# Altium schematic sheet MCU.SchDoc
size A4; SheetNumber: 3; SheetTotal: 6
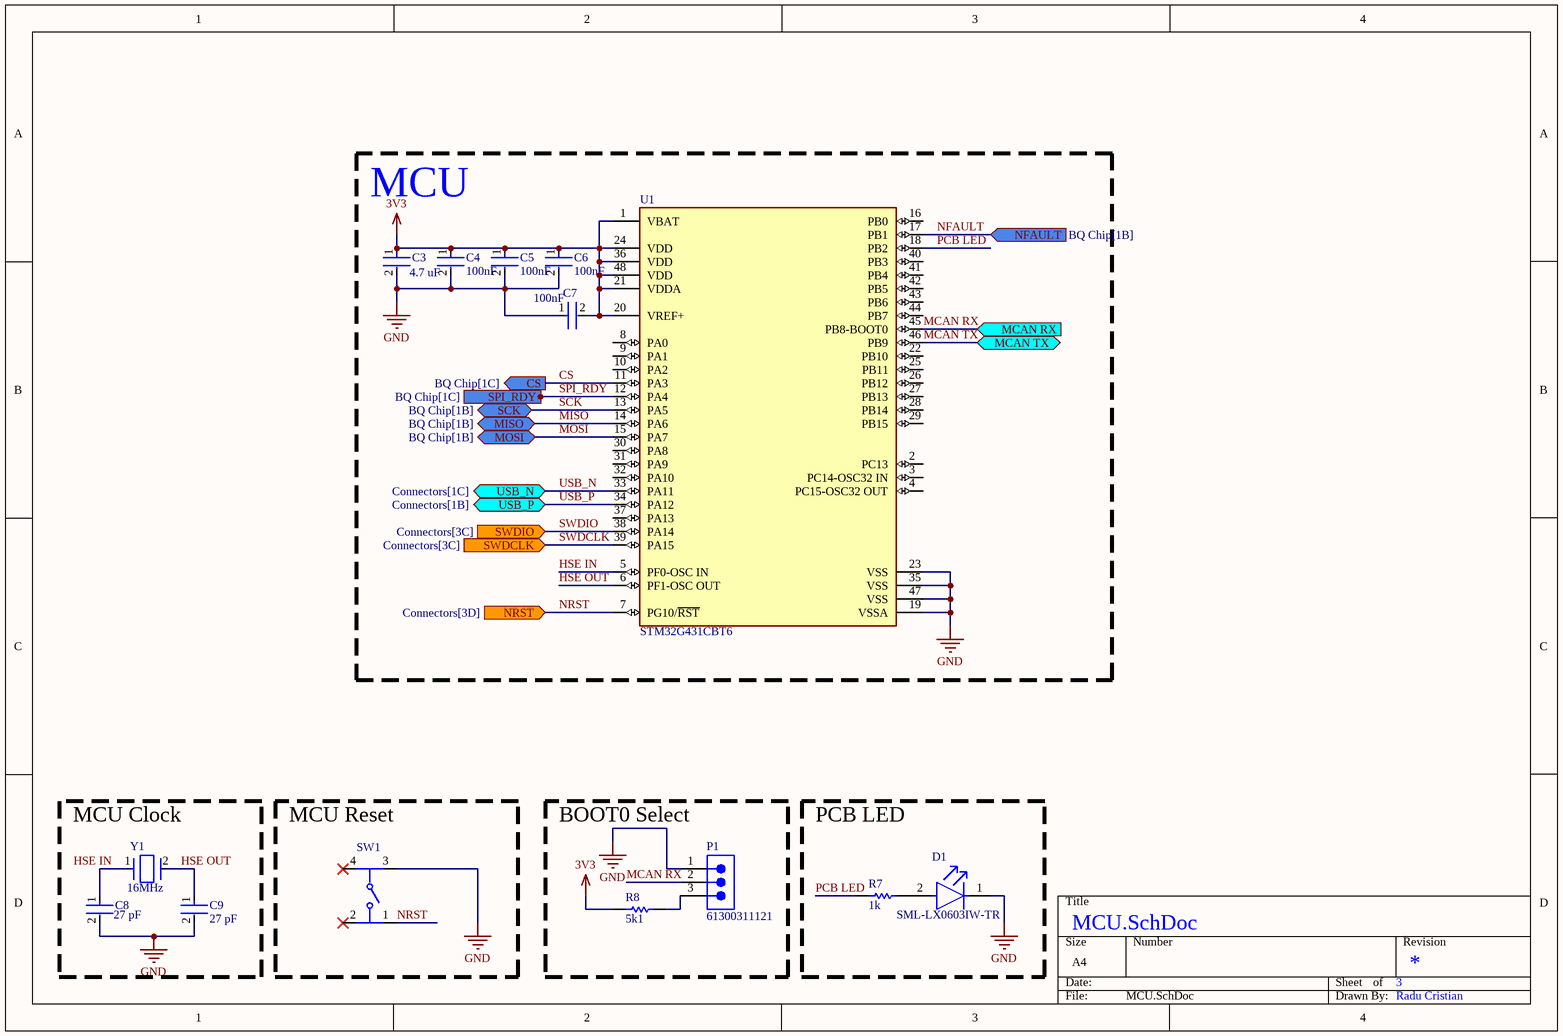
[diagram p0: MCU.SchDoc]

## Parts
C3  Capacitance: 4.7 uF  [FP-CC0603-DA-MFG]  (hidden comment: CC0603KRX5R5BB475)
C4  Capacitance: 100nF  [FP-CC0603-DA-IPC_A]  (hidden comment: CC0603JRX7R9BB104)
C5  Capacitance: 100nF  [FP-CC0603-DA-IPC_A]  (hidden comment: CC0603JRX7R9BB104)
C6  Capacitance: 100nF  [FP-CC0603-DA-IPC_A]  (hidden comment: CC0603JRX7R9BB104)
C7  Capacitance: 100nF  [FP-CC0603-DA-IPC_A]  (hidden comment: CC0603JRX7R9BB104)
C8  value 27 pF  [FP-C0603C-CF-MFG]  (hidden comment: C0603C270J5GACTU)
C9  value 27 pF  [FP-C0603C-CF-MFG]  (hidden comment: C0603C270J5GACTU)
D1  SML-LX0603IW-TR  [FP-SML-LX0603IW-TR-MFG]
P1  61300311121  [61300311121]
R7  Parameter 1: 1k  [RESC2013X70X40ML20T20]  (hidden comment: ERJ-6ENF1001V)
R8  Parameter 1: 5k1  [RESC2013X60X30NL20T20]  (hidden comment: RK73H2ATTD5101F)
SW1  PTS810SJM250SMTRLFS  [FP-PTS810SJM250SMTRLFS-MFG]  (value not drawn)
U1  STM32G431CBT6  [FP-LQFP48-5B-MFG]
Y1  Frequency: 16MHz  [FP-ABM3-MFG]  (hidden comment: ABM3-16.000MHZ-D2Y-T)

## Blocks framed on the sheet
MCU: C3-C7 U1
MCU Clock: C8 C9 Y1
MCU Reset: SW1
BOOT0 Select: P1 R8
PCB LED: D1 R7

## Ports
CS (out, see BQ Chip[1C]), MCAN RX (in, see Communication[1D]), MCAN TX (bidir, see Communication[1D]), MISO (bidir, see BQ Chip[1B]), MOSI (bidir, see BQ Chip[1B]), NFAULT (in, see BQ Chip[1B]), NRST (in, see Connectors[3D]), SCK (bidir, see BQ Chip[1B]), SPI_RDY (out, see BQ Chip[1C]), SWDCLK (in, see Connectors[3C]), SWDIO (in, see Connectors[3C]), USB_N (bidir, see Connectors[1C]), USB_P (bidir, see Connectors[1B])

## Nets
3V3: C3.1 C4.1 C5.1 C6.1 C7.2 R8.2 U1.1(VBAT) U1.20(VREF+) U1.21(VDDA) U1.24(VDD) U1.36(VDD) U1.48(VDD)
GND: C3.2 C4.2 C5.2 C6.2 C7.1 C8.2 C9.2 D1.1(C) P1.1 SW1.3 U1.19(VSSA) U1.23(VSS) U1.35(VSS) U1.47(VSS)
CS: U1.11(PA3) ; port CS
HSE IN: C8.1 U1.5(PF0-OSC_IN) Y1.1
HSE OUT: C9.1 U1.6(PF1-OSC_OUT) Y1.2
MCAN RX: P1.2 U1.45(PB8-BOOT0) ; port MCAN RX
MCAN TX: U1.46(PB9) ; port MCAN TX
MISO: U1.14(PA6) ; port MISO
MOSI: U1.15(PA7) ; port MOSI
NFAULT: U1.17(PB1) ; port NFAULT
NRST: SW1.1 U1.7(PG10/~{RST}) ; port NRST
PCB LED: R7.1 U1.18(PB2)
SCK: U1.13(PA5) ; port SCK
SPI_RDY: U1.12(PA4) ; port SPI_RDY
SWDCLK: U1.39(PA15) ; port SWDCLK
SWDIO: U1.38(PA14) ; port SWDIO
USB_N: U1.33(PA11) ; port USB_N
USB_P: U1.34(PA12) ; port USB_P
NetD1_2: D1.2(A) R7.2
NetP1_3: P1.3 R8.1

Not connected (* = marked no-connect by the designer): SW1 2* 4*; U1 2(PC13) 3(PC14-OSC32_IN) 4(PC15-OSC32_OUT) 8(PA0) 9(PA1) 10(PA2) 16(PB0) 22(PB10) 25(PB11) 26(PB12) 27(PB13) 28(PB14) 29(PB15) 30(PA8) 31(PA9) 32(PA10) 37(PA13) 40(PB3) 41(PB4) 42(PB5) 43(PB6) 44(PB7)

## Notes on the sheet
- Radu Cristian

## Library data of the parts
C3 = CMP-03422-000495-1: CAP CER 4.7UF 6.3V X5R 0603; Manufacturer: YAGEO; Tolerance: 0.1; Temperature Coefficient: 15%; Material: Ceramic; Voltage Rating: 6.3 V; Height: 0.9mm; Temperature Characteristic: X5R; Value: 4.7 uF; ComponentLink2Description: Datasheet; Mouser Description: Multilayer Ceramic Capacitor, CC Series, 4.7 - F, - 10%, X5R, 6.3 V, 0603 [1608 Metric]; Manufacturer Part Number: CC0603KRX5R5BB475; Voltage: 6.3 V; Device Class L3: Ceramic Capacitors; Temperature: -55°C to +125°C; Octopart: https://octopart.com/cc0603krx5r5bb475-yageo-42244632; Digikey Description: CAP CER 4.7UF 6.3V X5R 0603; Package: CC0603-DA; Device Class L2: Capacitors; Category: Cap; Footprint Url: http://www.yageo.com/exep/pages/download/literatures/UPY-C_GEN_24.pdf; ComponentLink2URL: http://www.yageo.com/documents/recent/UPY-GPHC_X7R_6.3V-to-50V_18.pdf; Temperature Range High: +125°C; Automotive: No; Temperature Range Low: -55°C; Lead Free: Yes; Device Class L1: Passive Components; RoHS: TRUE
C4-C7 = CMP-03422-001490-1: CAP CER 0.1UF 50V X7R 0603; Tolerance: 5%; Number of Pins: 2; Depth: 0.8mm; Weight: 7.1E-05oz; Radiation Hardening: No; Case Code (Metric): 1608; Dielectric: X7R; Max Operating Temperature: 125°C; Voltage Rating (DC): 50V; Case/Package: 0603; Halogen Free: Halogen Free; Mount: Surface Mount; Lead Free: Lead Free; Termination: SMD/SMT; RoHS Compliant: Yes; Length: 1.6mm; Series: CC; Resistor Type: Ceramic; Case Code (Imperial): 0603; Construction: Flat; Width: 0.031inch; Height: 0.8mm; Voltage Rating: 50V; Min Operating Temperature: -55°C; Thickness: 0.035inch; Packaging: Tape and Reel
C8 C9 = CMP-2006-03314-2: CAP CER 27PF 50V C0G/NP0 0603; Manufacturer: KEMET; Tolerance: 0.05; Material: Ceramic; Automotive Grade: Grade 1; Temperature Characteristic: C0G; Temperature Coefficient: 30ppm/°C; RoHS: TRUE; Lead Free: Yes; Automotive: Yes; Category: Cap; Digikey Description: CAP CER 27PF 50V C0G/NP0 0603; Device Class L3: Ceramic Capacitors; Capacitance: 27 pF; Temperature Range High: +125°C; Octopart: https://octopart.com/c0603c270j5gactu-kemet-136059; Temperature Range Low: -55°C; ComponentLink2URL: https://api.kemet.com/component-edge/download/datasheet/C0603C100J5GACAUTO.pdf; Device Class L2: Capacitors; Mouser Description: Multilayer Ceramic Capacitors MLCC - SMD/SMT 50volts 27pF C0G 5%; Device Class L1: Passive Components; ComponentLink2Description: Datasheet; Voltage Rating: 50 V; Package: C0603C-CF; Height: 0.87mm; Temperature: -55°C to +125°C; Manufacturer Part Number: C0603C270J5GACTU
D1 = CMP-57192-000012-1: LED RED DIFFUSED SMD; Luminous Intensity: 14mcd; Test Current: 20mA; Viewing Angle: 160°; Approvals: UL; Forward Voltage: 2V; Power Dissipation: 50mW; Dominant Wavelength: 635nm; Number of LEDs: 1; Lens Color: White; Height: 0.6mm; RoHS Compliant: Yes; Lead Free: Lead Free; Number of Pins: 2; Packaging: Tape and Reel; Case/Package: 0603; Length: 1.6mm; Color: Red; Max Operating Temperature: 85°C; Illumination Color: Red; Case Code (Metric): 1608; Diameter: 0.061inch; Min Operating Temperature: -25°C; Lens Style: Diffused; Mount: Surface Mount; Width: 0.8mm; Case Code (Imperial): 0603; Lens Transparency: Diffused; Wavelength: 635nm; Package Quantity: 1; Forward Current: 20mA
P1 = CMP-1502-01062-3: NexarPartId: 32855521; Current Rating: 3A; Voltage Rating: 250V; Number of Positions: 3; Pitch: 2.54mm; Contact Resistance: 20mΩ; Connector Type: Male Pin; Gender: Male; REACH SVHC: Unknown; Packaging: Bulk; Contact Material: Copper; Min Operating Temperature: -40°C; Number of Rows: 1; Orientation: Vertical; RoHS: Compliant; Contact Plating: Gold; Max Operating Temperature: 105°C; Mount: Through Hole; Height: 8.94mm; Operating Supply Voltage: 250V; Number of Pins: 3; Contact Mating Length: 5.9944mm; Number of Contacts: 3; Color: Black; Lead Free: Lead Free; Lead Pitch: 2.54mm; Termination: Solder
R7 = CMP-2001-04375-5: Chip Resistor, 1 KOhm, +/- 1%, 0.125 W, -55 to 155 degC, 0805 (2012 Metric), RoHS, Tape and Reel; Manufacturer: Panasonic; Voltage Rating: 150 V; ComponentLink1URL: http://www.panasonic.com/; ComponentLink2Description: Datasheet; REACH SVHC: Yes; ComponentLink1Description: Manufacturer URL; Length: 2 mm; Height: 0.6 mm; Package Quantity: 1; PackageDescription: 2-Pin Surface Mount Device, Body 2 x 1.25 mm; Packaging: Cut Tape; PackageReference: 0805; Max Operating Temperature: 155 degC; Mounting Technology: Surface Mount; ComponentLink2URL: http://industrial.panasonic.com/cdbs/www-data/pdf/RDA0000/AOA0000C86.pdf; DatasheetVersion: 04/2015; Min Operating Temperature: -55 degC; RoHSCompliant: true; Mount: Surface Mount
R8 = CMP-2001-02431-1: Manufacturer: KOA Speer; Part Number: RK73H2ATTD5101F
SW1 = CMP-10040-000001-2: SWITCH TACTILE SPST-NO 0.05A 16V; Throw Configuration: SPST; Operating Force: 160gf; Actuator Type: Standard; Switch Travel: 0.15mm; Switch Function: Off-Mom; Max Current Rating: 50mA; Mechanical Life: 150000Cycles; Illumination Type: Non-Illuminated; Package Quantity: 2900; Depth: 4.6mm; Mount: Surface Mount; Packaging: Tape and Reel; Length: 3.2mm; RoHS Compliant: Yes; Case/Package: SMD/SMT; Voltage Rating (DC): 16V; Min Operating Temperature: -40°C; Termination: J-Bend; Lead Free: Lead Free; Contact Plating: Silver; Orientation: Straight; Max Operating Temperature: 85°C; Current Rating: 50mA; Color: Black
U1 = CMP-12105-000030-1: MAINSTREAM ARM CORTEX-M4+ MCU 17; Manufacturer: STMicroelectronics; Number Of Adc Channels: 17; Number Of I/Os: 38; Standoff Height: 0.05mm; Number Of Usb Channels: 1; Data Bus Width: 32bits; Number Of I2C Channels: 3; Number Of Pwm Channels: 31; Frequency: 170MHz; Memory Type: FLASH; Number Of Timers/Counters: 14; Ram Size: 32KBytes; Max Junction Temp: +105°C; Memory Size: 128KBytes; Min Supply Voltage: 1.62V; Max Supply Voltage: 3.6V; Number Of Uart Channels: 4; Interface: I2C,SPI,UART,USART,CAN,USB,LIN,IrDA,I2S; Temperature Range Low: -40°C; Lead Free: Yes; Device Class L3: Microcontrollers; Number Of Cores: 1; Temperature Range High: +85°C; Height: 1.6mm; Digikey Description: MAINSTREAM ARM CORTEX-M4+ MCU 17; Device Class L1: Integrated Circuits (ICs); Package: LQFP48-5B; RoHS: TRUE; Number Of A/D Converters: 1; Core Architecture: Arm Cortex-M4; Device Class L2: Embedded Processors and Controllers; ComponentLink2Description: Datasheet; Temperature: -40°C to +85°C; Ambient Temperature Range High: +85°C; Ambient Temperature Range Low: -40°C; Octopart: https://octopart.com/stm32g431cbt6-stmicroelectronics-98835224; ComponentLink2URL: https://www.st.com/resource/en/datasheet/stm32g431cb.pdf; Automotive: No; Number Of Spi Channels: 3; Manufacturer Part Number: STM32G431CBT6; Category: IC
Y1 = CMP-27762-004490-1: Crystal 16MHz ±20ppm 18pF SMD-2 5mm x 3.2mm; Frequency Stability: 30ppm; Series Resistance: 40R; Tolerance: 20ppm; Frequency Tolerance: 20ppm; Load Capacitance: 18pF; Resistor Type: Ceramic; Termination: SMD/SMT; Width: 0.126inch; Mount: Surface Mount; RoHS Compliant: Yes; Package Quantity: 1000; Height: 0.051inch; Length: 0.197inch; Operating Frequency: 16 MHz; Packaging: Tape and Reel; Max Operating Temperature: 85°C; Series: ABM3; Case/Package: SMD/SMT; Lead Free: Lead Free; ESR (Equivalent Series Resistance): 40R; Number of Pins: 2; Min Operating Temperature: -40°C